# Altium schematic sheet FMC connector.SchDoc: FMC Connector
size 420 x 297 mm; CheckedBy: M.C., T.W.,  E.B.; CompanyName: CERN; DrawnBy: Greg Kasprowicz; Organization: CERN; Address1: European Organization for Nuclear Research; Address2: CH-1211 Geneve 23 - SwitzerLA_Pd; DocumentNumber: 3; Revision: -; SheetNumber: 3; SheetTotal: 9; EDA_Number: EDA-XXXXX-XX-X; Projet: FMC Delay 1ns 4cha; ModifiedBy: -; CreateDate: 10/07/2010; CheckedDate: -; DivGrp: BE-CO; Designer: Greg Kasprowicz,; PageSetup: Record=PageOptions|CenterHorizontal=True|CenterVertical=True|PrintScale=0.96|XCorrection=1.00|YCorrection=1.00|PrintKind=1|BorderSize=5000000|LeftOffset=0|BottomOffset=0|Orientation=2|PaperLength=1000|PaperWidth=1000|Scale=100|PaperSource=15|PrintQuality=600|MediaType=1|DitherType=10|PaperKind=A3|PrintScaleMode=1; ModifiedDate: -
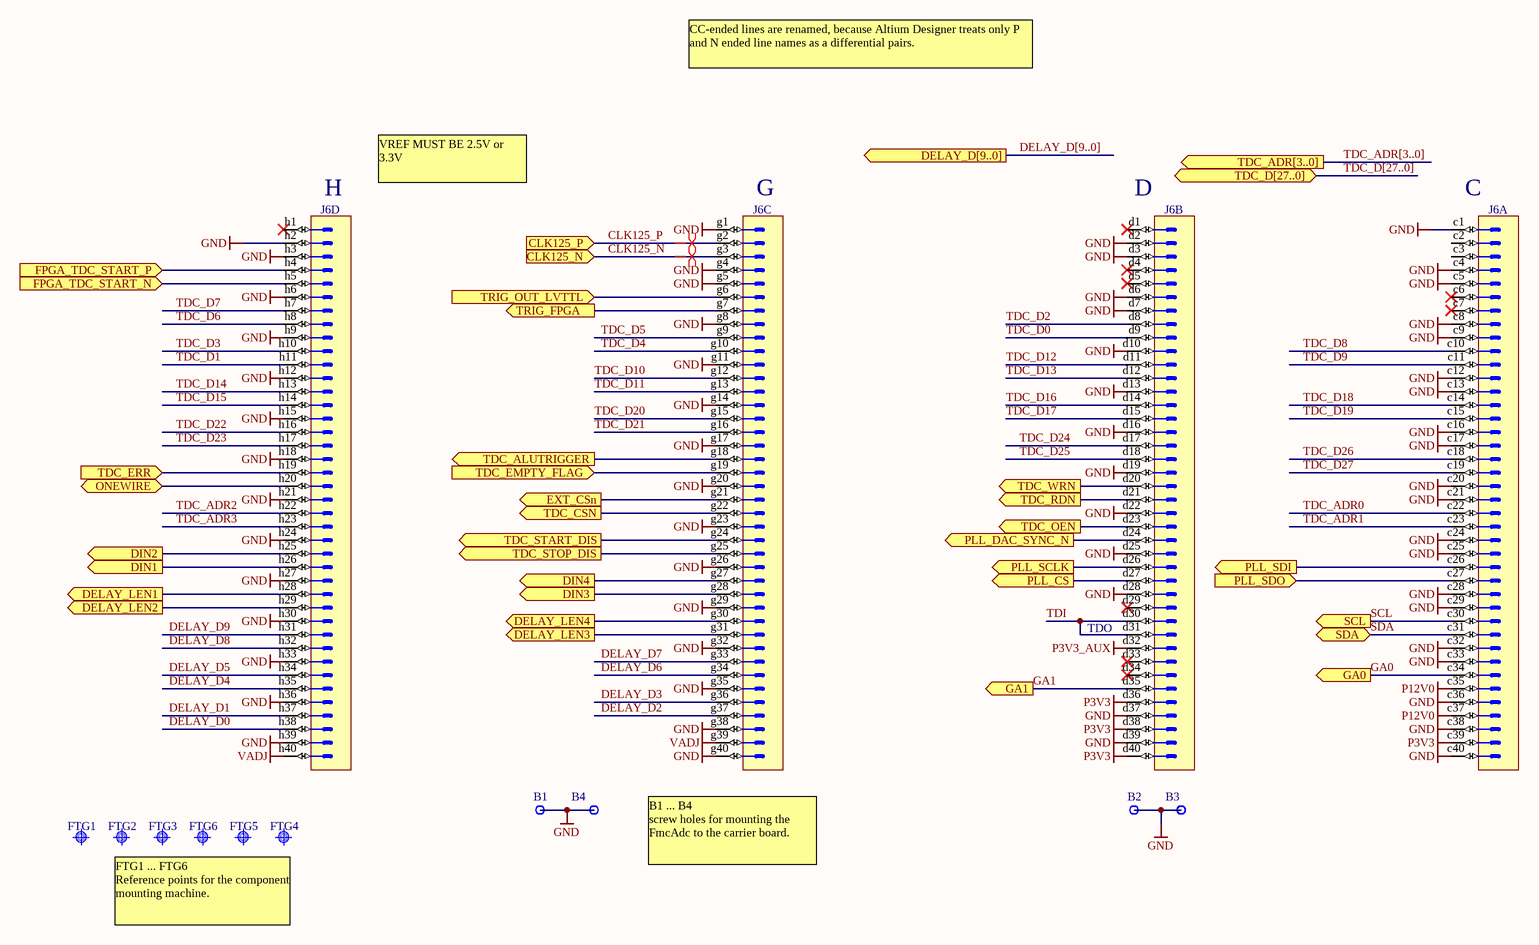
[diagram p0: FMC connector.SchDoc]

## Parts
B1  Plated Hole  [MTG300_600]  (value not drawn)
B2  Plated Hole  [MTG300_600]  (value not drawn)
B3  Plated Hole  [MTG300_600]  (value not drawn)
B4  Plated Hole  [MTG300_600]  (value not drawn)
FTG1  Use only in PCB  [FIDUCIAL_TOP_S100-200]  (value not drawn)
FTG2  Use only in PCB  [FIDUCIAL_TOP_S100-200]  (value not drawn)
FTG3  Use only in PCB  [FIDUCIAL_TOP_S100-200]  (value not drawn)
FTG4  Use only in PCB  [FIDUCIAL_TOP_S100-200]  (value not drawn)
FTG5  Use only in PCB  [FIDUCIAL_TOP_S100-200]  (value not drawn)
FTG6  Use only in PCB  [FIDUCIAL_TOP_S100-200]  (value not drawn)
J6  VITA 57  [SAMTEC_ASP-127797-01]  (value not drawn)  (parts A,B,C,D of 4)

## Ports
CLK125_N (in), CLK125_P (in), DELAY_D[9..0] (out), DELAY_LEN1 (out), DELAY_LEN2 (out), DELAY_LEN3 (out), DELAY_LEN4 (out), DIN1 (out), DIN2 (out), DIN3 (out), DIN4 (out), EXT_CSn (out), FPGA_TDC_START_N (in), FPGA_TDC_START_P (in), GA0 (out), GA1 (out), ONEWIRE (bidir), PLL_CS (out), PLL_DAC_SYNC_N (out), PLL_SCLK (out), PLL_SDI (out), PLL_SDO (in), SCL (out), SDA (bidir), TDC_ADR[3..0] (out), TDC_ALUTRIGGER (out), TDC_CSN (out), TDC_D[27..0] (bidir), TDC_EMPTY_FLAG (in), TDC_ERR (in), TDC_OEN (out), TDC_RDN (out), TDC_START_DIS (out), TDC_STOP_DIS (out), TDC_WRN (out), TRIG_FPGA (out), TRIG_OUT_LVTTL (in)

## Nets
GND: B1.1 B2.1 B3.1 B4.1 J6.c1 J6.c4 J6.c5 J6.c8 J6.c9 J6.c12 J6.c13 J6.c16 J6.c17 J6.c20 J6.c21 J6.c24 J6.c25 J6.c28 J6.c29 J6.c32 J6.c33 J6.c36 J6.c38 J6.c40 J6.d2 J6.d3 J6.d6 J6.d7 J6.d10 J6.d13 J6.d16 J6.d19 J6.d22 J6.d25 J6.d28 J6.d37 J6.d39 J6.g1 J6.g4 J6.g5 J6.g8 J6.g11 J6.g14 J6.g17 J6.g20 J6.g23 J6.g26 J6.g29 J6.g32 J6.g35 J6.g38 J6.g40 J6.h2 J6.h3 J6.h6 J6.h9 J6.h12 J6.h15 J6.h18 J6.h21 J6.h24 J6.h27 J6.h30 J6.h33 J6.h36 J6.h39
P3V3: J6.c39 J6.d36 J6.d38 J6.d40
P3V3_AUX: J6.d32
P12V0: J6.c35 J6.c37
VADJ: J6.g39 J6.h40
CLK125_N: J6.g3 ; port CLK125_N
CLK125_P: J6.g2 ; port CLK125_P
DELAY_D0: J6.h38
DELAY_D1: J6.h37
DELAY_D2: J6.g37
DELAY_D3: J6.g36
DELAY_D4: J6.h35
DELAY_D5: J6.h34
DELAY_D6: J6.g34
DELAY_D7: J6.g33
DELAY_D8: J6.h32
DELAY_D9: J6.h31
DELAY_LEN1: J6.h28 ; port DELAY_LEN1
DELAY_LEN2: J6.h29 ; port DELAY_LEN2
DELAY_LEN3: J6.g31 ; port DELAY_LEN3
DELAY_LEN4: J6.g30 ; port DELAY_LEN4
DIN1: J6.h26 ; port DIN1
DIN2: J6.h25 ; port DIN2
DIN3: J6.g28 ; port DIN3
DIN4: J6.g27 ; port DIN4
EXT_CSn: J6.g21 ; port EXT_CSn
FPGA_TDC_START_N: J6.h5 ; port FPGA_TDC_START_N
FPGA_TDC_START_P: J6.h4 ; port FPGA_TDC_START_P
GA0: J6.c34 ; port GA0
GA1: J6.d35 ; port GA1
ONEWIRE: J6.h20 ; port ONEWIRE
PLL_CS: J6.d27 ; port PLL_CS
PLL_DAC_SYNC_N: J6.d24 ; port PLL_DAC_SYNC_N
PLL_SCLK: J6.d26 ; port PLL_SCLK
PLL_SDI: J6.c26 ; port PLL_SDI
PLL_SDO: J6.c27 ; port PLL_SDO
SCL: J6.c30 ; port SCL
SDA: J6.c31 ; port SDA
TDC_ADR0: J6.c22
TDC_ADR1: J6.c23
TDC_ADR2: J6.h22
TDC_ADR3: J6.h23
TDC_ALUTRIGGER: J6.g18 ; port TDC_ALUTRIGGER
TDC_CSN: J6.g22 ; port TDC_CSN
TDC_D0: J6.d9
TDC_D1: J6.h11
TDC_D2: J6.d8
TDC_D3: J6.h10
TDC_D4: J6.g10
TDC_D5: J6.g9
TDC_D6: J6.h8
TDC_D7: J6.h7
TDC_D8: J6.c10
TDC_D9: J6.c11
TDC_D10: J6.g12
TDC_D11: J6.g13
TDC_D12: J6.d11
TDC_D13: J6.d12
TDC_D14: J6.h13
TDC_D15: J6.h14
TDC_D16: J6.d14
TDC_D17: J6.d15
TDC_D18: J6.c14
TDC_D19: J6.c15
TDC_D20: J6.g15
TDC_D21: J6.g16
TDC_D22: J6.h16
TDC_D23: J6.h17
TDC_D24: J6.d17
TDC_D25: J6.d18
TDC_D26: J6.c18
TDC_D27: J6.c19
TDC_EMPTY_FLAG: J6.g19 ; port TDC_EMPTY_FLAG
TDC_ERR: J6.h19 ; port TDC_ERR
TDC_OEN: J6.d23 ; port TDC_OEN
TDC_RDN: J6.d21 ; port TDC_RDN
TDC_START_DIS: J6.g24 ; port TDC_START_DIS
TDC_STOP_DIS: J6.g25 ; port TDC_STOP_DIS
TDC_WRN: J6.d20 ; port TDC_WRN
TDI: J6.d30 J6.d31
TRIG_FPGA: J6.g7 ; port TRIG_FPGA
TRIG_OUT_LVTTL: J6.g6 ; port TRIG_OUT_LVTTL

Not connected (* = marked no-connect by the designer): J6 c2 c3 c6* c7* d1* d4* d5* d29* d33* d34* h1*

## Buses and harness runs
bus DELAY_D[9..0] = port DELAY_D[9..0]
bus TDC_ADR[3..0] = port TDC_ADR[3..0]
bus TDC_D[27..0] = port TDC_D[27..0]

## Layout directives
differential pair: CLK125_N, CLK125_P

## Notes on the sheet
- CC-ended lines are renamed, because Altium Designer treats only P and N ended line names as a differential pairs.
- (near J6) H
- VREF MUST BE 2.5V or 3.3V
- (near J6) G
- (near J6) D
- (near J6) C
- (near J6) TDO
- FTG1 ... FTG6
  Reference points for the component mounting machine.
- B1 ... B4
  screw holes for mounting the FmcAdc to the carrier board.
- Project/Equipment
- Document
- Designer
- Drawn by
- Check.by
- File
- Last Mod.
- Print Date
- Sheet
- Size
- A3
- of
- Rev

## Library data of the parts
B1-B4 = PLATED_HOLE3.0_PAD6.0: Single Terminal Socket; Part Description: Plated Through Hole: Hole Dia.=3.0mm Pad Dia.=6.0mm; Mounted: No; Table: Pads; Part Number: PLATED_HOLE3.0_PAD6.0; Component Kind: Standard (No BOM); Component Type: Standard (No BOM); Designator: Single Terminal Socket; Library Reference: Single Terminal Socket; Pin Count: 1; Family: Plated Hole; Socket: No; SMD: No; Status: None; ComponentHeight: 0mm; Author: CERN DEM JLC; CreateDate: 5/26/2008; LatestRevisionDate: 5/26/2008; PackageDescription: Plated Through Hole: Hole Dia.=3.0mm Pad Dia.=6.0mm
FTG1-FTG6 = FIDUCIAL_TARGET_S100-200: Fiducial Target; Part Description: Scare Fiducial Target, Top Layer, 1.0mm, Top Sloder 2.0mm, Keepout =2.0mm; Mounted: No; Table: Pads; Part Number: FIDUCIAL_TARGET_S100-200; Component Kind: Standard (No BOM); Component Type: Standard (No BOM); Pin Count: 1; Family: Fiducial; Socket: No; SMD: Yes; Status: None; ComponentHeight: 0mm; Author: CERN DEM JLC; CreateDate: 2/9/2010; LatestRevisionDate: 2/9/2010; PackageDescription: Scare Fiducial Target, Top Layer, 1.0mm, Top Sloder 2.0mm, Keepout =2.0mm
J6 = SAMTEC_ASP-127797-01: Connector VITA 57, 160 Male contacts in 4 row cdgh; Part Description: 160 contacts (4 rows cdgh) Surface Mount Male Connector, VITA 57; Manufacturer: SAMTEC; Manufacturer Part Number: ASP-134488-01; Part Number: SAMTEC_ASP-127797-01; Component Kind: Standard; Component Type: Standard; Pin Count: 160; Family: VITA 57; Mounted: Yes; Socket: No; SMD: Yes; Status: None; ComponentHeight: 6.1mm; HelpURL: \\cern.ch\dfs\Applications\Altium\Datasheets\SAMTEC_ASP-127797-01.pdf; Author: CERN DEM JLC; CreateDate: 9/24/2009; LatestRevisionDate: 9/24/2009; Table: SAMTEC